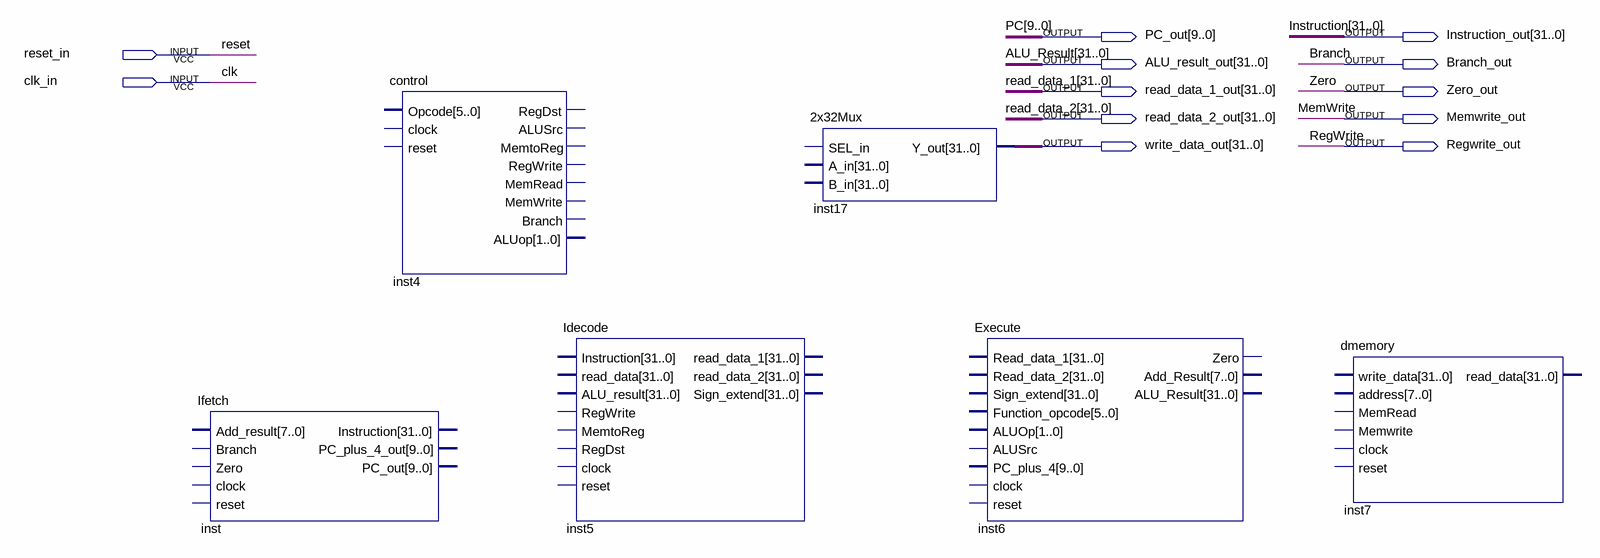
[diagram p0: schematic sheet]
// Quartus schematic MIPS.bdf as structural Verilog: 6 symbols, 12 pins
module MIPS (
  input  reset_in,
  input  clk_in,
  output [9:0] PC_out,
  output [31:0] Instruction_out,
  output [31:0] ALU_result_out,
  output Branch_out,
  output [31:0] read_data_1_out,
  output Zero_out,
  output [31:0] read_data_2_out,
  output Memwrite_out,
  output [31:0] write_data_out,
  output Regwrite_out
);

  Ifetch inst ();  // open: Add_result, Branch, Zero, clock, reset, Instruction, PC_plus_4_out, PC_out
  control inst4 ();  // open: Opcode, clock, reset, RegDst, ALUSrc, MemtoReg, RegWrite, MemRead, MemWrite, Branch, ALUop
  Idecode inst5 ();  // open: Instruction, read_data, ALU_result, RegWrite, MemtoReg, RegDst, clock, reset, read_data_1, read_data_2, Sign_extend
  \2x32Mux  inst17 (.Y_out(write_data_out));  // open: SEL_in, A_in, B_in
  Execute inst6 ();  // open: Read_data_1, Read_data_2, Sign_extend, Function_opcode, ALUOp, ALUSrc, PC_plus_4, clock, reset, Zero, Add_Result, ALU_Result
  dmemory inst7 ();  // open: write_data, address, MemRead, Memwrite, clock, reset, read_data

  // Other names for the same wires on the sheet: ALU_Result[31:0] = ALU_result_out; Branch = Branch_out; clk = clk_in;
  //   Instruction[31:0] = Instruction_out; MemWrite = Memwrite_out; PC[9:0] = PC_out;
  //   read_data_1[31:0] = read_data_1_out; read_data_2[31:0] = read_data_2_out; RegWrite = Regwrite_out;
  //   reset = reset_in; Zero = Zero_out
endmodule
